# Altium schematic sheet mboard_mcu.SchDoc: =GlobalProjectName
size 410 x 297 mm; SheetNumber: 2; SheetTotal: 2; PageSetup: Record=PageOptions|CenterHorizontal=True|CenterVertical=True|PrintScale=1.00|XCorrection=1.00|YCorrection=1.00|PrintKind=1|BorderSize=5000000|LeftOffset=0|BottomOffset=0|Orientation=2|PaperLength=1000|PaperWidth=1000|Scale=100|PaperSource=15|PrintQuality=1200|MediaType=1|DitherType=10|PaperKind=A3|PrintScaleMode=1; Weight: -; ScaleFactor: -
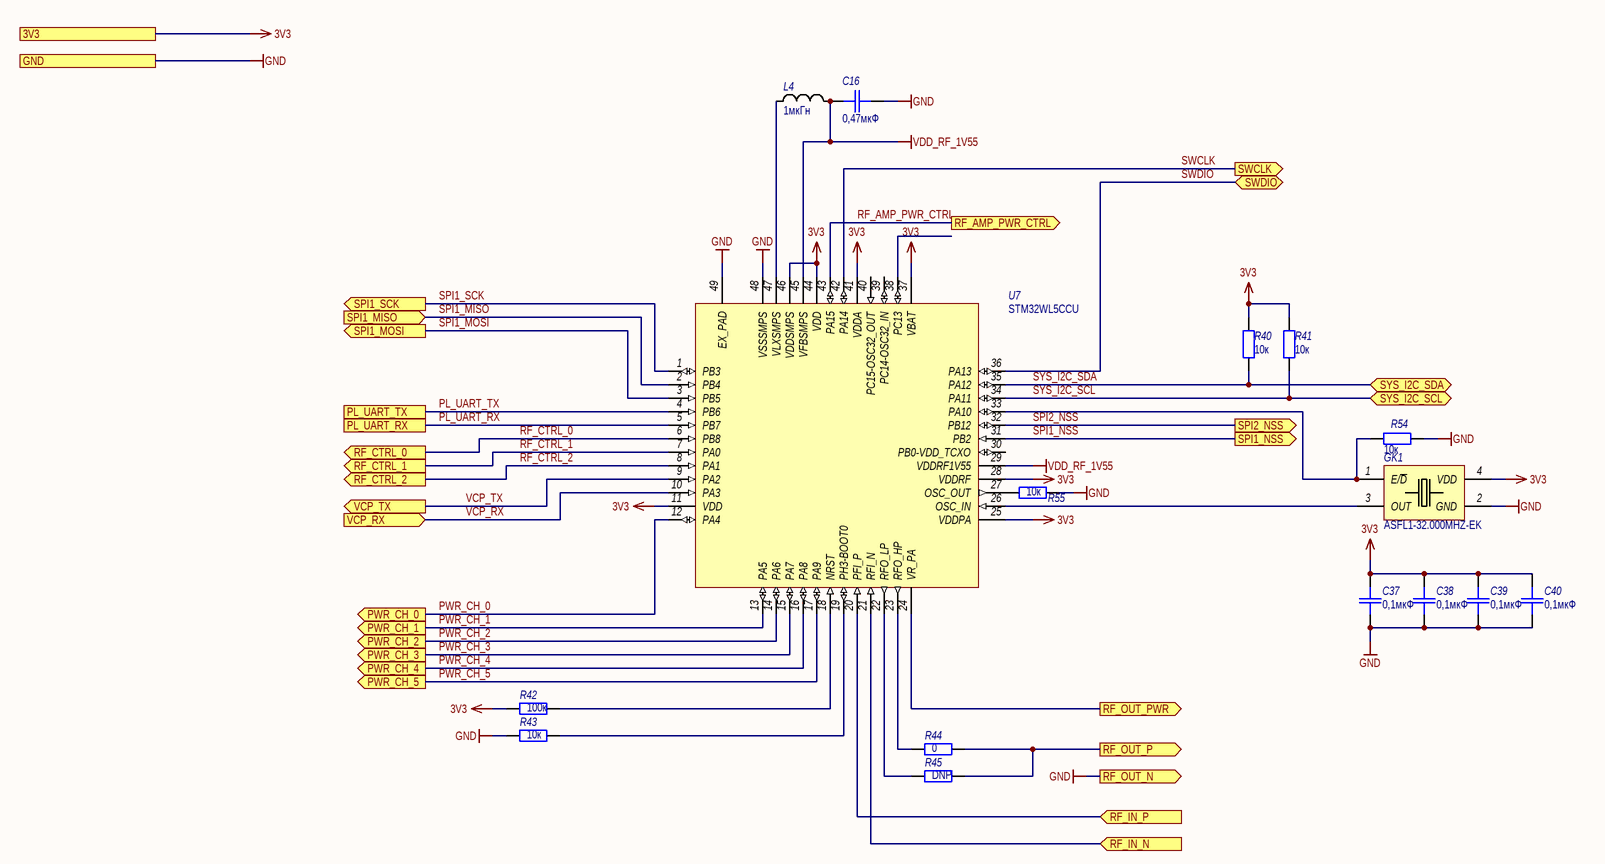
[diagram p0: mboard_mcu.SchDoc]

## Parts
C16  value 0,47мкФ  [SMD_C0402]  (hidden comment: K10-79)
C37  value 0,1мкФ  [SMD_C0402]  (hidden comment: K10-79)
C38  value 0,1мкФ  [SMD_C0402]  (hidden comment: K10-79)
C39  value 0,1мкФ  [SMD_C0402]  (hidden comment: K10-79)
C40  value 0,1мкФ  [SMD_C0402]  (hidden comment: K10-79)
GK1  ASFL1-32.000MHZ-EK  [SMD_3025_Crustal_Oscilator]
L4  1мкГн  [SMD_0805]
R40  value 10к  [SMD_0805]  (hidden comment: OSM R1-12)
R41  value 10к  [SMD_0805]  (hidden comment: OSM R1-12)
R42  value 100к  [SMD_0805]  (hidden comment: OSM R1-12)
R43  value 10к  [SMD_0805]  (hidden comment: OSM R1-12)
R44  value 0  [SMD_0805]  (hidden comment: OSM R1-12)
R45  value DNP  [SMD_0805]  (hidden comment: OSM R1-12)
R54  value 10к  [SMD_0805]  (hidden comment: OSM R1-12)
R55  value 10к  [SMD_0805]  (hidden comment: OSM R1-12)
U7  STM32WL5CCU  [UQFNPN48]

## Ports
3V3, GND, PL_UART_RX, PL_UART_TX, PWR_CH_0 (out), PWR_CH_1 (out), PWR_CH_2 (out), PWR_CH_3 (out), PWR_CH_4 (out), PWR_CH_5 (out), RF_AMP_PWR_CTRL (out), RF_CTRL_0 (out), RF_CTRL_1 (out), RF_CTRL_2 (out), RF_IN_N (in), RF_IN_P (in), RF_OUT_N (out), RF_OUT_P (out), RF_OUT_PWR (out), SPI1_MISO (in), SPI1_MOSI (out), SPI1_NSS (out), SPI1_SCK (out), SPI2_NSS (out), SWCLK (out), SWDIO (bidir), SYS_I2C_SCL (bidir), SYS_I2C_SDA (bidir), VCP_RX (in), VCP_TX (out)

## Nets
3V3: C37.1 C38.1 C39.1 C40.1 GK1.4(VDD) R40.2 R41.2 R42.1 U7.11(VDD) U7.25(VDDPA) U7.28(VDDRF) U7.37(VBAT) U7.41(VDDA) U7.44(VDD) U7.46(VDDSMPS) ; port 3V3
GND: C16.2 C37.2 C38.2 C39.2 C40.2 GK1.2(GND) R43.1 R54.1 R55.2 U7.48(VSSSMPS) U7.49(EX_PAD) ; port GND, port RF_OUT_N
VDD_RF_1V55: C16.1 L4.2 U7.29(VDDRF1V55) U7.45(VFBSMPS)
PL_UART_RX: U7.5(PB7) ; port PL_UART_RX
PL_UART_TX: U7.4(PB6) ; port PL_UART_TX
PWR_CH_0: U7.12(PA4) ; port PWR_CH_0
PWR_CH_1: U7.13(PA5) ; port PWR_CH_1
PWR_CH_2: U7.14(PA6) ; port PWR_CH_2
PWR_CH_3: U7.15(PA7) ; port PWR_CH_3
PWR_CH_4: U7.16(PA8) ; port PWR_CH_4
PWR_CH_5: U7.17(PA9) ; port PWR_CH_5
RF_AMP_PWR_CTRL: U7.43(PA15) ; port RF_AMP_PWR_CTRL
RF_CTRL_0: U7.6(PB8) ; port RF_CTRL_0
RF_CTRL_1: U7.7(PA0) ; port RF_CTRL_1
RF_CTRL_2: U7.8(PA1) ; port RF_CTRL_2
RF_IN_N: U7.21(RFI_N) ; port RF_IN_N
RF_IN_P: U7.20(PFI_P) ; port RF_IN_P
RF_OUT_P: R44.2 R45.2 ; port RF_OUT_P
RF_OUT_PWR: U7.24(VR_PA) ; port RF_OUT_PWR
SPI1_MISO: U7.2(PB4) ; port SPI1_MISO
SPI1_MOSI: U7.3(PB5) ; port SPI1_MOSI
SPI1_NSS: U7.31(PB2) ; port SPI1_NSS
SPI1_SCK: U7.1(PB3) ; port SPI1_SCK
SPI2_NSS: U7.32(PB12) ; port SPI2_NSS
SWCLK: U7.42(PA14) ; port SWCLK
SWDIO: U7.36(PA13) ; port SWDIO
SYS_I2C_SCL: R41.1 U7.34(PA11) ; port SYS_I2C_SCL
SYS_I2C_SDA: R40.1 U7.35(PA12) ; port SYS_I2C_SDA
VCP_RX: U7.10(PA3) ; port VCP_RX
VCP_TX: U7.9(PA2) ; port VCP_TX
NetGK1_1: GK1.1(E/~{D}) R54.2 U7.33(PA10)
NetGK1_3: GK1.3(OUT) U7.26(OSC_IN)
NetL4_1: L4.1 U7.47(VLXSMPS)
NetR42_2: R42.2 U7.18(NRST)
NetR43_2: R43.2 U7.19(PH3-BOOT0)
NetR44_1: R44.1 U7.23(RFO_HP)
NetR45_1: R45.1 U7.22(RFO_LP)
NetR55_1: R55.1 U7.27(OSC_OUT)

Not connected (* = marked no-connect by the designer): U7 30(PB0-VDD_TCXO) 38(PC13) 39(PC14-OSC32_IN) 40(PC15-OSC32_OUT)

## Notes on the sheet
- Подп. и дата
- Инв. № дубл.
- Взам. инв. №
- Инв. № подл.
- Изм.
- Лист
- № докум.
- Подп.
- Дата
- Форма 2а ГОСТ 2.104-2006
- Копировал
- Формат А3

## Library data of the parts
C16 C37-C40 = Capacitor: Назначение: SMD-конденсатор; Наименование: К10-79; Потребление, Вт: 0; Точность: %; Напряжение: В; Диэлектрик: *
GK1 = Crystal_Oscillator_2: Crystall oscillator, CMOS, 3.3V, SMD3025; Назначение: XO SMD 3.3V 32.000MHZ 3.2X5MM; Потребление, Вт: 0,165; ComponentLink1Description: DataSheet; ComponentLink1URL: https://abracon.com/Oscillators/ASFL1.pdf; Наименование: ASFL1-32.000MHZ-EK
L4 = Inductor: Наименование: Индуктивность; Назначение: SMD-индуктивность; Потребление, Вт: 0,010; Value: 1мкГн
R40-R45 R54 R55 = Resistor: Наименование: ОСМ Р1-12; Назначение: SMD-резистор; Потребление, Вт: 0,001; Точность: %
U7 = STM32WL5CCU: Multiprotocol Wireless 32-bit MCU with LPWAN Sub-GHz radio solution; Потребление, Вт: 0.3; ComponentLink1Description: Datasheet; ComponentLink1URL: https://www.st.com/resource/en/datasheet/stm32wle5c8.pdf; Назначение: Multiprotocol Wireless 32-bit MCU with LPWAN Sub-GHz radio solution; Наименование: STM32WL5CCU